# EAGLE schematic UV_MONITOR (EAGLE 8.4.0)
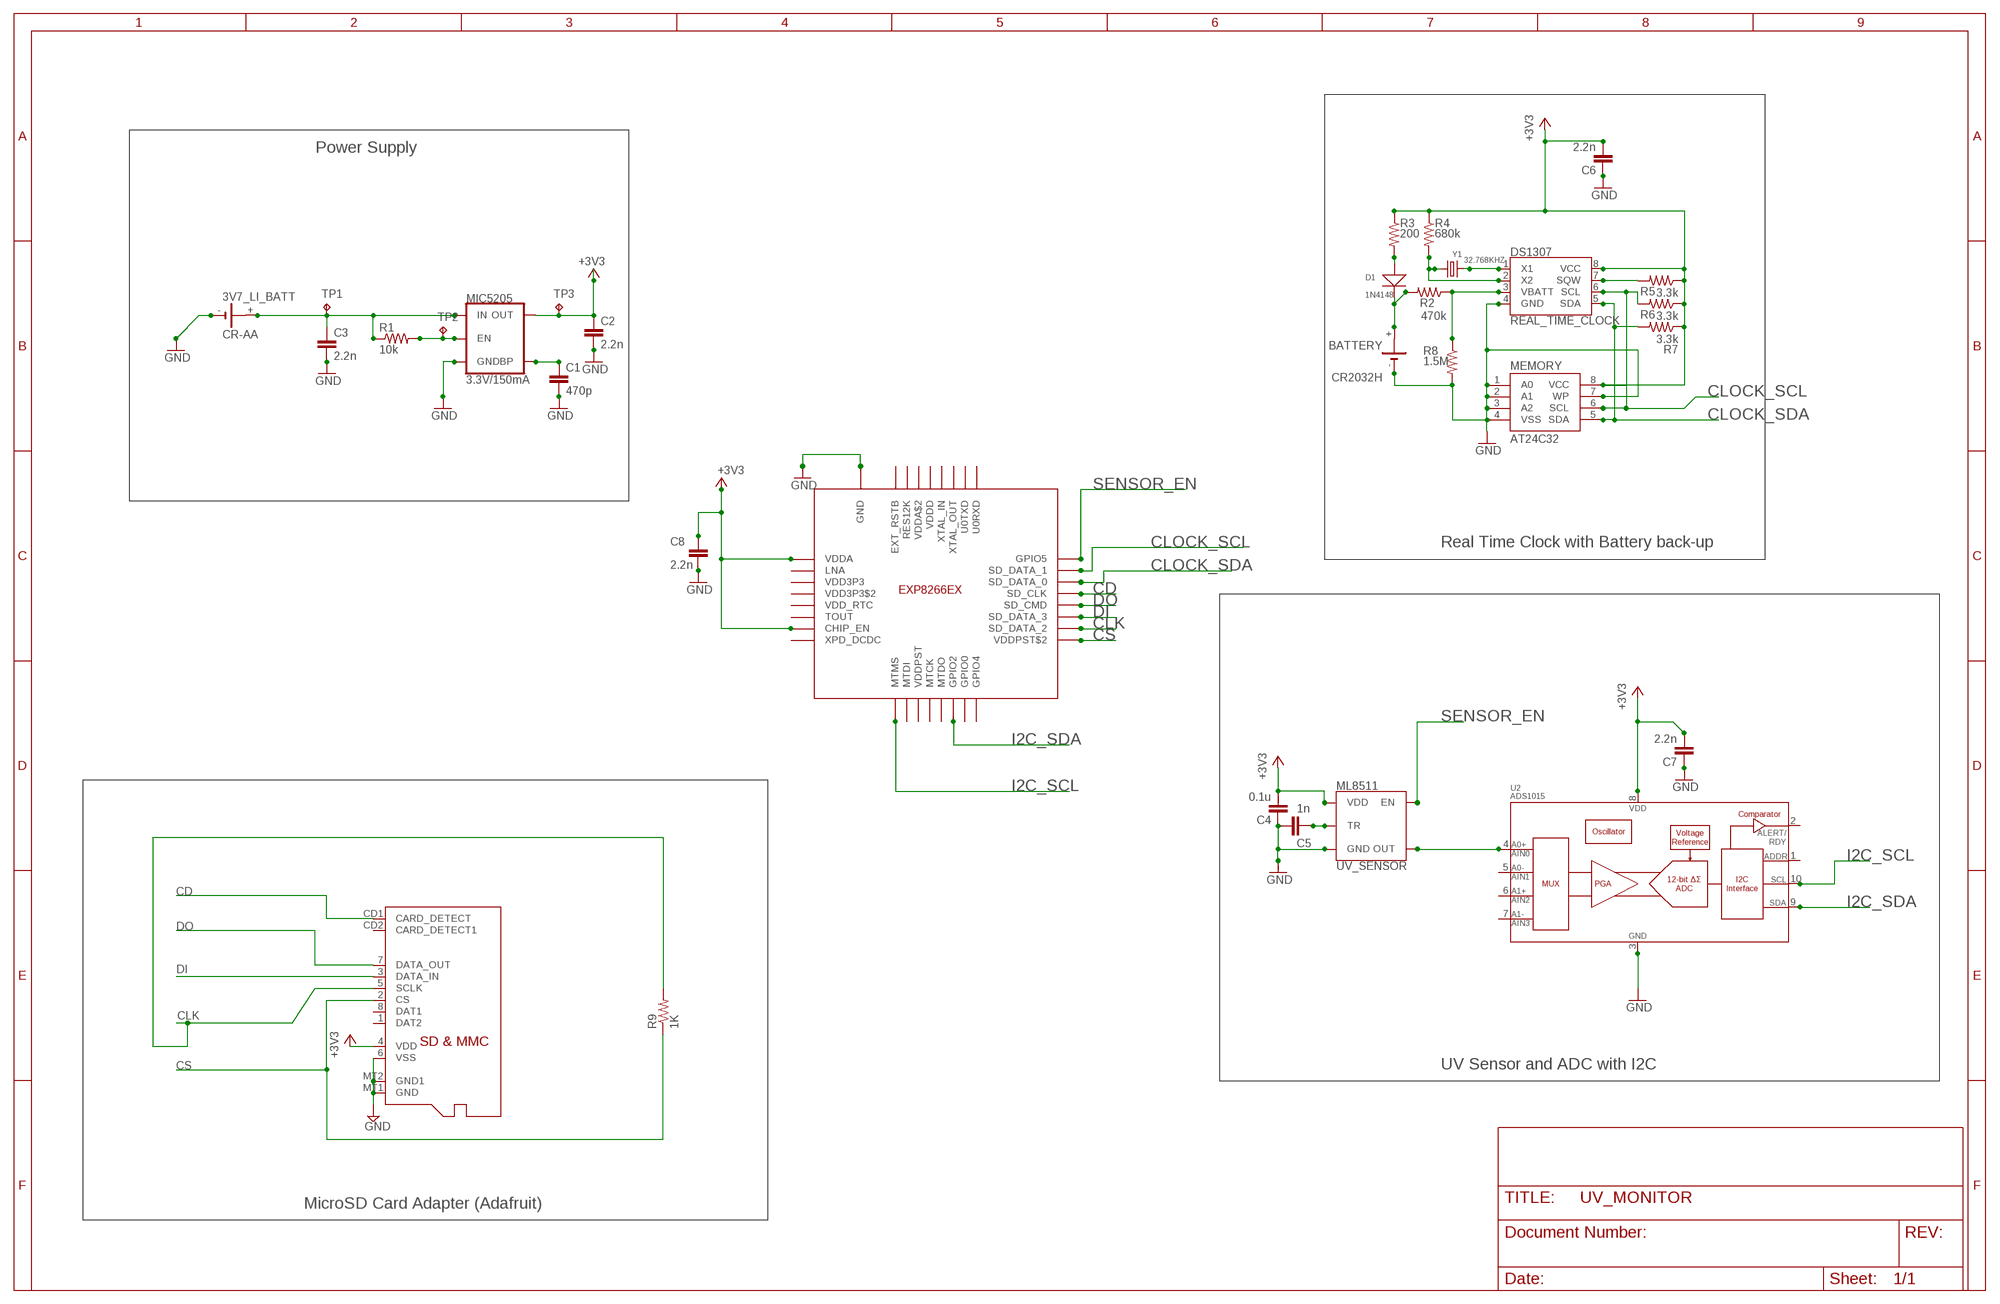
[diagram p0: schematic, sheet 1]

## Parts
3V7_LI_BATT  CR-AA  [CRAA]
BATTERY  CR2032H  [CR2032H]
C1  470p  C-EUC0805  [C0805]
C2  2.2n  C-EUC0805  [C0805]
C3  2.2n  C-EUC0805  [C0805]
C4  0.1u  C-EUC0805  [C0805]
C5  1n  C-EUC0805  [C0805]
C6  2.2n  C-EUC0805  [C0805]
C7  2.2n  C-EUC0805  [C0805]
C8  2.2n  C-EUC0805  [C0805]
D1  1N4148  SMD-DIODE-SWITCH-1N4148(LL-34)  [LL-34]
DS1307  REAL_TIME_CLOCK  DS1307Z  [SO08-0.15]
MEMORY  AT24C32  EEPROM-I2CSMD  [SO08]
MIC5205  3.3V/150mA  V_REG_MIC52053.3V  [SOT23-5]
ML8511  UV_SENSOR  ML8511  [ML8511]
R1  10k  R-US_R0805  [R0805]
R2  470k  R-US_R0805  [R0805]
R3  200  R-US_R0805  [R0805]
R4  680k  R-US_R0805  [R0805]
R5  3.3k  R-US_R0805  [R0805]
R6  3.3k  R-US_R0805  [R0805]
R7  3.3k  R-US_R0805  [R0805]
R8  1.5M  R-US_R0805  [R0805]
R9  1K  R-US_R0805  [R0805]
TP1  TPPAD1-13  [P1-13]
TP2  TPPAD1-13  [P1-13]
TP3  TPPAD1-13  [P1-13]
U1  ESP8266EX  [ESP8266EX]
U2  ADS1015  [MSOP10]
X1  MICROSD  [MICROSD]
Y1  32.768KHZ  SMD-CRYSTAL-ABS07-32.768KHZ-7PF-20PPM-70K(2P-3.2X1.5MM)  [X2-SMD-3.2X1.5X0.55MM]

## Nets
+3V3: C2.1 C4.2 C6.2 C7.2 C8.1 DS1307.8(VCC) MEMORY.8(VCC) MIC5205.5(OUT) ML8511.7(VDD) R3.1 R4.1 R5.1 R6.1 R7.1 TP3.TP U1.CHIP_EN U1.VDDA U2.8(VDD) X1.4(VDD)
CD: U1.SD_CLK X1.CD1(CARD_DETECT)
CLK: R9.2 U1.SD_DATA_2 X1.5(SCLK)
CLOCK_SCL: DS1307.6(SCL) MEMORY.6(SCL) R6.2 U1.SD_DATA_1
CLOCK_SDA: DS1307.5(SDA) MEMORY.5(SDA) R7.2 U1.SD_DATA_0
CS: R9.1 U1.VDDPST$2 X1.2(CS)
DI: U1.SD_DATA_3 X1.3(DATA_IN)
DO: U1.SD_CMD X1.7(DATA_OUT)
GND: 3V7_LI_BATT.- BATTERY.- C1.2 C2.2 C3.2 C4.1 C5.2 C6.1 C7.1 C8.2 DS1307.4(GND) MEMORY.1(A0) MEMORY.2(A1) MEMORY.3(A2) MEMORY.4(VSS) MEMORY.7(WP) MIC5205.2(GND) ML8511.5(GND) R8.2 U1.GND U2.3(VSS) X1.6(VSS) X1.MT1(GND) X1.MT2(GND1)
I2C_SCL: U1.MTMS U2.10(SCL)
I2C_SDA: U1.GPIO2 U2.9(SDA)
N$1: 3V7_LI_BATT.+ C3.1 MIC5205.1(IN) R1.1 TP1.TP
N$3: MIC5205.3(EN) R1.2 TP2.TP
N$4: C5.1 ML8511.10(TR)
N$5: C1.1 MIC5205.4(BP)
N$7: DS1307.1(X1) Y1.2
N$8: DS1307.7(SQW) R5.2
N$9: DS1307.3(VBATT) R2.1 R8.1
N$10: BATTERY.+ D1.C(-) R2.2
N$11: D1.A(+) R3.2
N$12: DS1307.2(X2) R4.2 Y1.1
N$13: ML8511.8(OUT) U2.4(AIN0)
SENSOR_EN: ML8511.4(EN) U1.GPOIO5(GPIO5)
Unconnected: 3V7_LI_BATT.+@1(+) BATTERY.+@1(+) U1.EXT_RSTB U1.GPIO0 U1.GPIO4 U1.LNA U1.MTCK U1.MTDI U1.MTDO U1.RES12K U1.TOUT U1.U0RXD U1.U0TXD U1.VDD3P3 U1.VDD3P3$2 U1.VDD_RTC U1.VDDA$2 U1.VDDD U1.VDDPST U1.XPD_DCDC U1.XTAL_IN U1.XTAL_OUT U2.1(ADDR) U2.2(ALERT/RDY) U2.5(AIN1) U2.6(AIN2) U2.7(AIN3) X1.1(DAT2) X1.8(DAT1) X1.CD2(CARD_DETECT1)

## Notes on the sheet
- Power Supply
- Real Time Clock with Battery back-up
- UV Sensor and ADC with I2C
- MicroSD Card Adapter (Adafruit)

## Library data of the parts
3V7_LI_BATT = battery:CR-AA: LI BATTERY Varta CRAA-SLF
BATTERY = battery:CR2032H: LI BATTERY Varta
C1-C8 = rcl:C-EU: CAPACITOR, European symbol
D1 = Seeed-Diode:SMD-DIODE-SWITCH-1N4148(LL-34): 304040016; MPN: 1N4148
DS1307 = SparkFun-Clocks:DS1307: Maxim DS1307 - I2C Real-time clock (RTC) The DS1307 serial real-time clock (RTC) is a low-power, full binary-coded decimal (BCD) clock/calendar plus 56 bytes of NV SRAM. Address and data are transferred serially through an I2C, bidirectional bus. The clock/calendar provides seconds, minutes, hours, day, date, month, and year information. SparkFun Products: Real Time Clock Module <https://www.sparkfun.com/products/12708> (BOB-12708) Datasheet <https://cdn.sparkfun.com/datasheets/BreakoutBoards/DS1307.pdf>; PROD_ID: IC-08138
MEMORY = SparkFun-IC-Memory:EEPROM-I2C: I2C EEPROMs, 24LC256 and others 24LC256 Series 256 kb I2C 2 Wire (32 k x 8 Bit) 2.5 V Serial EEPROM SMD - SOIC-8 Datasheet SparkFun Products SparkFun UDB5 - PIC UAV Development Board <https://www.sparkfun.com/products/11703> (GPS-11703); PROD_ID: IC-09714; VALUE: 24LC256
MIC5205 = SparkFun-IC-Power:V_REG_MIC5205: V_REG MIC5205 Standard 3.3V, 5V, and Adjustable 150mA LDO voltage regulator in SOT-23 layout. Micrel part MIC5205. BP (by-pass) pin is used to lower output noise with 470pF cap, may be left open. On the adjustable version BP is used to set output.; PROD_ID: VREG-00822
ML8511 = SparkFun-Sensors:ML8511: Lapis ML8511 Ultraviolet Sensor The MP8511 UV (ultraviolet) Sensor works by outputing an analog signal in relation to the amount of UV light that’s detected. This sensor detects 280-390nm light most effectively. This is categorized as part of the UVB (burning rays) spectrum and most of the UVA (tanning rays) spectrum. It outputs a analog voltage that is linearly related to the measured UV intensity (mW/cm2). Datasheet <https://cdn.sparkfun.com/datasheets/Sensors/LightImaging/ML8511_3-8-13.pdf> SparkFun Products SparkFun UV Sensor Breakout - ML8511 <https://www.sparkfun.com/products/12705> (SEN-12705); PROD_ID: IC-11927
R1-R8 = rcl:R-US_: RESISTOR, American symbol
R9 = adafruit:R-US_: RESISTOR, American symbol
TP1-TP3 = testpad:TP: Test pad
U1 = ESP8266EX:ESP8266EX
U2 = SparkFun-IC-Conversion:ADS1015: ADS1015 12-BIT ADC 12-Bit Del-Sig ADC Four single-ended inputs or two differential inputs Internal PGA I2C interface 2.0-5.5V SparkFun Products SparkFun Block for Intel Edison - ADC <https://www.sparkfun.com/products/13770> (DEV-13770); PROD_ID: IC-12270
X1 = adafruit:MICROSD: Micro-SD / Transflash card holder with SPI pinout For the 3M # 2908-05WB-MG and/or 4UCON #19656 push-push type
Y1 = Seeed-Crystal Oscillator:SMD-CRYSTAL-ABS07-32.768KHZ-7PF-20PPM-70K(2P-3.2X1.5MM): 306010055; MPN: FC-135